# Altium schematic sheet Display Roll.SchDoc
size A; SheetNumber: 5; SheetTotal: 6
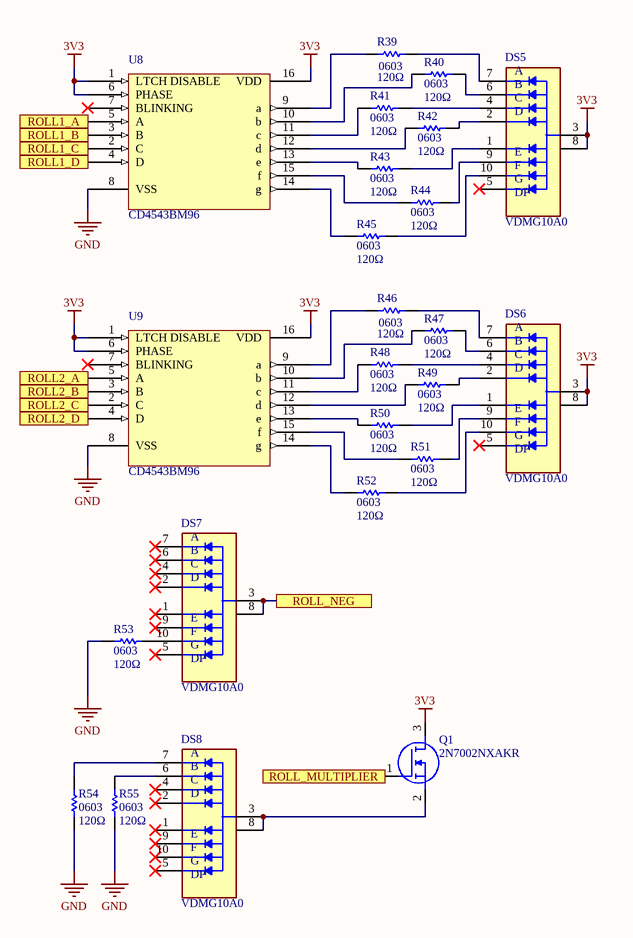
[diagram p0: Display Roll.SchDoc]

## Parts
DS5  VDMG10A0  [DISPLAY_VDMG10A0]
DS6  VDMG10A0  [DISPLAY_VDMG10A0]
DS7  VDMG10A0  [DISPLAY_VDMG10A0]
DS8  VDMG10A0  [DISPLAY_VDMG10A0]
Q1  2N7002NXAKR  [TO-236AB]
R39  value 120Ω  Package/Footprint: 0603  [RES0603]  (hidden comment: RES_120Ω_0603)
R40  value 120Ω  Package/Footprint: 0603  [RES0603]  (hidden comment: RES_120Ω_0603)
R41  value 120Ω  Package/Footprint: 0603  [RES0603]  (hidden comment: RES_120Ω_0603)
R42  value 120Ω  Package/Footprint: 0603  [RES0603]  (hidden comment: RES_120Ω_0603)
R43  value 120Ω  Package/Footprint: 0603  [RES0603]  (hidden comment: RES_120Ω_0603)
R44  value 120Ω  Package/Footprint: 0603  [RES0603]  (hidden comment: RES_120Ω_0603)
R45  value 120Ω  Package/Footprint: 0603  [RES0603]  (hidden comment: RES_120Ω_0603)
R46  value 120Ω  Package/Footprint: 0603  [RES0603]  (hidden comment: RES_120Ω_0603)
R47  value 120Ω  Package/Footprint: 0603  [RES0603]  (hidden comment: RES_120Ω_0603)
R48  value 120Ω  Package/Footprint: 0603  [RES0603]  (hidden comment: RES_120Ω_0603)
R49  value 120Ω  Package/Footprint: 0603  [RES0603]  (hidden comment: RES_120Ω_0603)
R50  value 120Ω  Package/Footprint: 0603  [RES0603]  (hidden comment: RES_120Ω_0603)
R51  value 120Ω  Package/Footprint: 0603  [RES0603]  (hidden comment: RES_120Ω_0603)
R52  value 120Ω  Package/Footprint: 0603  [RES0603]  (hidden comment: RES_120Ω_0603)
R53  value 120Ω  Package/Footprint: 0603  [RES0603]  (hidden comment: RES_120Ω_0603)
R54  value 120Ω  Package/Footprint: 0603  [RES0603]  (hidden comment: RES_120Ω_0603)
R55  value 120Ω  Package/Footprint: 0603  [RES0603]  (hidden comment: RES_120Ω_0603)
U8  CD4543BM96  [SOIC127P600X175-16N]
U9  CD4543BM96  [SOIC127P600X175-16N]

## Ports
ROLL1_A (in), ROLL1_B (in), ROLL1_C (in), ROLL1_D (in), ROLL2_A (in), ROLL2_B (in), ROLL2_C (in), ROLL2_D (in), ROLL_MULTIPLIER (in), ROLL_NEG

## Nets
3V3: DS5.3(ANODE) DS5.8(ANODE) DS6.3(ANODE) DS6.8(ANODE) Q1.3(D) U8.1(LTCH_DISABLE) U8.6(PHASE) U8.16(VDD) U9.1(LTCH_DISABLE) U9.6(PHASE) U9.16(VDD)
GND: R53.1 R54.1 R55.1 U8.8(VSS) U9.8(VSS)
ROLL1_A: U8.5(A) ; port ROLL1_A
ROLL1_B: U8.3(B) ; port ROLL1_B
ROLL1_C: U8.2(C) ; port ROLL1_C
ROLL1_D: U8.4(D) ; port ROLL1_D
ROLL2_A: U9.5(A) ; port ROLL2_A
ROLL2_B: U9.3(B) ; port ROLL2_B
ROLL2_C: U9.2(C) ; port ROLL2_C
ROLL2_D: U9.4(D) ; port ROLL2_D
ROLL_MULTIPLIER: Q1.1(G) ; port ROLL_MULTIPLIER
ROLL_NEG: DS7.3(ANODE) DS7.8(ANODE) ; port ROLL_NEG
NetDS5_1: DS5.1(E) R43.2
NetDS5_2: DS5.2(D) R42.2
NetDS5_4: DS5.4(C) R41.2
NetDS5_6: DS5.6(B) R40.2
NetDS5_7: DS5.7(A) R39.2
NetDS5_9: DS5.9(F) R44.2
NetDS5_10: DS5.10(G) R45.2
NetDS6_1: DS6.1(E) R50.2
NetDS6_2: DS6.2(D) R49.2
NetDS6_4: DS6.4(C) R48.2
NetDS6_6: DS6.6(B) R47.2
NetDS6_7: DS6.7(A) R46.2
NetDS6_9: DS6.9(F) R51.2
NetDS6_10: DS6.10(G) R52.2
NetDS7_10: DS7.10(G) R53.2
NetDS8_3: DS8.3(ANODE) DS8.8(ANODE) Q1.2(S)
NetDS8_6: DS8.6(B) R55.2
NetDS8_7: DS8.7(A) R54.2
NetR39_1: R39.1 U8.9(a)
NetR40_1: R40.1 U8.10(b)
NetR41_1: R41.1 U8.11(c)
NetR42_1: R42.1 U8.12(d)
NetR43_1: R43.1 U8.13(e)
NetR44_1: R44.1 U8.15(f)
NetR45_1: R45.1 U8.14(g)
NetR46_1: R46.1 U9.9(a)
NetR47_1: R47.1 U9.10(b)
NetR48_1: R48.1 U9.11(c)
NetR49_1: R49.1 U9.12(d)
NetR50_1: R50.1 U9.13(e)
NetR51_1: R51.1 U9.15(f)
NetR52_1: R52.1 U9.14(g)

Not connected (* = marked no-connect by the designer): DS5 5(DP)*; DS6 5(DP)*; DS7 1(E)* 2(D)* 4(C)* 5(DP)* 6(B)* 7(A)* 9(F)*; DS8 1(E)* 2(D)* 4(C)* 5(DP)* 9(F)* 10(G)*; U8 7(BLINKING)*; U9 7(BLINKING)*

## Library data of the parts
DS5-DS8 = 7 SEG DISPLAY - VDMG10A0: Smart/Normal 7 Seg Numeric LED Display; Manufacturer: Vishay Semiconductors; Package: SMD-10 Vishay; MP: VDMG10A0; Supplier 1: Digi-Key; Manufacturer Part Number: VDMG10A0; RoHS: Yes; Category: LED Displays; Stock 1: 6191; Pricing 1: 1=1.55000, 10=1.38200, 100=1.07760 (USD); Optoelectronic Device Type: SMART/NORMAL 7 SEG NUMERIC LED DISPLAY; REACH SVHC: No SVHC; RoHS Compliant: Yes; ComponentLink1URL: https://datasheet.ciiva.com:443/pdfs/VipMasterIC/IC/VISH/VISH-S-A0001108912/VISH-S-A0001108912-1.pdf?src-supplier=IHS+Markit; ComponentLink1Description: https://datasheet.ciiva.com:443/pdfs/VipMasterIC/IC/VISH/VISH-S-A0001108912/VISH-S-A0001108912-1.pdf?src-supplier=IHS+Markit; ComponentLink2URL: https://datasheet.ciiva.com/24075/vdmx10x0-272413-24075313.pdf?src-supplier=Mouser; ComponentLink2Description: https://datasheet.ciiva.com/24075/vdmx10x0-272413-24075313.pdf?src-supplier=Mouser; ComponentLink3URL: https://datasheet.ciiva.com/23867/vdmx10x0-23867376.pdf?src-supplier=Newark; ComponentLink3Description: https://datasheet.ciiva.com/23867/vdmx10x0-23867376.pdf?src-supplier=Newark; ComponentLink4URL: https://datasheet.ciiva.com/29566/vdmx10x0-29566054.pdf?src-supplier=Digi-Key; ComponentLink4Description: https://datasheet.ciiva.com/29566/vdmx10x0-29566054.pdf?src-supplier=Digi-Key; ComponentLink5URL: https://datasheet.ciiva.com/29566/vdmx10x0-29566055.pdf?src-supplier=Digi-Key; ComponentLink5Description: https://datasheet.ciiva.com/29566/vdmx10x0-29566055.pdf?src-supplier=Digi-Key; ComponentLink6URL: https://datasheet.ciiva.com/29566/vdmx10x0-29566056.pdf?src-supplier=Digi-Key; ComponentLink6Description: https://datasheet.ciiva.com/29566/vdmx10x0-29566056.pdf?src-supplier=Digi-Key; ComponentLink7URL: https://datasheet.ciiva.com/30017/vdmx10x0-30017276.pdf?src-supplier=Avnet; ComponentLink7Description: https://datasheet.ciiva.com/30017/vdmx10x0-30017276.pdf?src-supplier=Avnet; ComponentLink8URL: https://datasheet.ciiva.com/23867/1809851-23867367.pdf?src-supplier=Newark; ComponentLink8Description: https://datasheet.ciiva.com/23867/1809851-23867367.pdf?src-supplier=Newark; ComponentLink9URL: https://datasheet.ciiva.com/22726/1913356-22726255.pdf?src-supplier=Element14; ComponentLink9Description: https://datasheet.ciiva.com/22726/1913356-22726255.pdf?src-supplier=Element14; ComponentLink10URL: https://datasheet.ciiva.com/24208/vdmx10x0-24208888.pdf?src-supplier=Future+Electronics; ComponentLink10Description: https://datasheet.ciiva.com/24208/vdmx10x0-24208888.pdf?src-supplier=Future+Electronics; Supplier Part Number 1: VDMG10A0CT-ND
Q1 = MOSFET N-60V-190mA: Transistor Mosfet N-ch 60V 0.3A 3-PIN TO-263AB T/r; Manufacturer: Nexperia; MF: Nexperia USA Inc.; Value: *; Check_prices: https://www.snapeda.com/parts/2N7002NXAKR/Nexperia/view-part/4480350/?ref=eda; Availability: Good; Package: SOT23-3 Nexperia USA Inc.; SnapEDA_Link: https://www.snapeda.com/parts/2N7002NXAKR/Nexperia/view-part/4480350/?ref=snap; Price: None; Purchase-URL: https://pricing.snapeda.com/search/part/2N7002NXAKR/?ref=eda; MP: 2N7002NXAKR; Supplier 1: Digi-Key; Manufacturer Part Number: 2N7002NXAKR; RoHS: No; Stock 1: 47085; Pricing 1: 1=0.11000, 10=0.09800, 25=0.09360, 100=0.05360, 500=0.03298, 1000=0.02249 (USD); ComponentLink1URL: http://www.farnell.com/datasheets/2842563.pdf?src-supplier=Farnell; ComponentLink1Description: http://www.farnell.com/datasheets/2842563.pdf?src-supplier=Farnell; ComponentLink2URL: http://www.farnell.com/datasheets/2842563.pdf?src-supplier=Element14; ComponentLink2Description: http://www.farnell.com/datasheets/2842563.pdf?src-supplier=Element14; ComponentLink3URL: http://www.farnell.com/datasheets/2842563.pdf?src-supplier=Newark; ComponentLink3Description: http://www.farnell.com/datasheets/2842563.pdf?src-supplier=Newark; Supplier Part Number 1: 1727-8643-1-ND
R39-R55 = RES_120Ω_0603_5%: RES 120 OHM 5% 1/10W 0603; Manufacturer 1: Yageo; Manufacturer Part Number 1: RC0603JR-07120RL; Supplier Part Number 1: 311-120GRCT-ND; Supplier 1: Digi-Key; Mounting Type: SMD
U8 U9 = 7 SEG DISPLAY IC: Seven Segment Decoder/Driver, 4000/14000/40000 Series, Configurable Output, CMOS, PDSO16; Manufacturer: Texas Instruments; Package Body Material: Plastic; Input Conditioning: LATCHED; Number of Functions: 1; Propagation Delay (tpd): 1200ns; Supply Voltage-Max (Vsup): 18V; Supply Voltage-Min (Vsup): 3V; Supply Voltage-Nom (Vsup): 5V; Qualification Status: Not Qualified; Supplier 1: Digi-Key; RoHS: Yes; Category: Decoders and Multiplexers; Stock 1: 1242; Pricing 1: 1=0.44000, 10=0.37800, 25=0.35240, 100=0.28200, 250=0.26184, 500=0.22154, 1000=0.17119 (USD); Package Code: SOP; Number of Pins: 16; Package Shape: Rectangular; Terminal Finish: Nickel; Min Operating Temperature: -55°C; Max Operating Temperature: 125°C; JESD-609 Code: e4; Output Polarity: Configurable; JESD-30 Code: R-PDSO-G16; Logic IC Type: SEVEN SEGMENT DECODER/DRIVER; Moisture Sensitivity Level: 1; Package Style: SMALL OUTLINEMeter; Peak Reflow Temperature (Cel): 260°C; Surface Mount: Yes; Technology: CMOS; Terminal Form: Gull Wing; Terminal Position: DUAL; Length: 9.9mm; Width: 3.9mm; Height - Seated (Max): 1.75mm; Terminal Pitch: 1.27mm; Temperature Grade: MILITARY; REACH SVHC: Yes; RoHS Compliant: Yes; ComponentLink1URL: https://www.ti.com:443/lit/ds/symlink/cd4543b.pdf?src-supplier=IHS+Markit; ComponentLink1Description: https://www.ti.com:443/lit/ds/symlink/cd4543b.pdf?src-supplier=IHS+Markit; ComponentLink2URL: https://datasheet.ciiva.com/15092/getdatasheetpartid-635761-15092907.pdf?src-supplier=Verical; ComponentLink2Description: https://datasheet.ciiva.com/15092/getdatasheetpartid-635761-15092907.pdf?src-supplier=Verical; ComponentLink3URL: https://datasheet.ciiva.com/41457/001013540-da-01-en-ic-bcd-7seg-ltch-cd4543bm96-soic-16-tid-41457278.pdf?src-supplier=Conrad; ComponentLink3Description: https://datasheet.ciiva.com/41457/001013540-da-01-en-ic-bcd-7seg-ltch-cd4543bm96-soic-16-tid-41457278.pdf?src-supplier=Conrad; ComponentLink4URL: https://datasheet.ciiva.com/6612/cd4543b-6612264.pdf?src-supplier=Digi-Key; ComponentLink4Description: https://datasheet.ciiva.com/6612/cd4543b-6612264.pdf?src-supplier=Digi-Key; ComponentLink5URL: https://datasheet.ciiva.com/6612/cd4543b-6612265.pdf?src-supplier=Digi-Key; ComponentLink5Description: https://datasheet.ciiva.com/6612/cd4543b-6612265.pdf?src-supplier=Digi-Key; ComponentLink6URL: https://datasheet.ciiva.com/6612/cd4543b-6612267.pdf?src-supplier=Digi-Key; ComponentLink6Description: https://datasheet.ciiva.com/6612/cd4543b-6612267.pdf?src-supplier=Digi-Key; Supplier Part Number 1: 296-31539-1-ND; Manufacturer Part Number: CD4543BM96